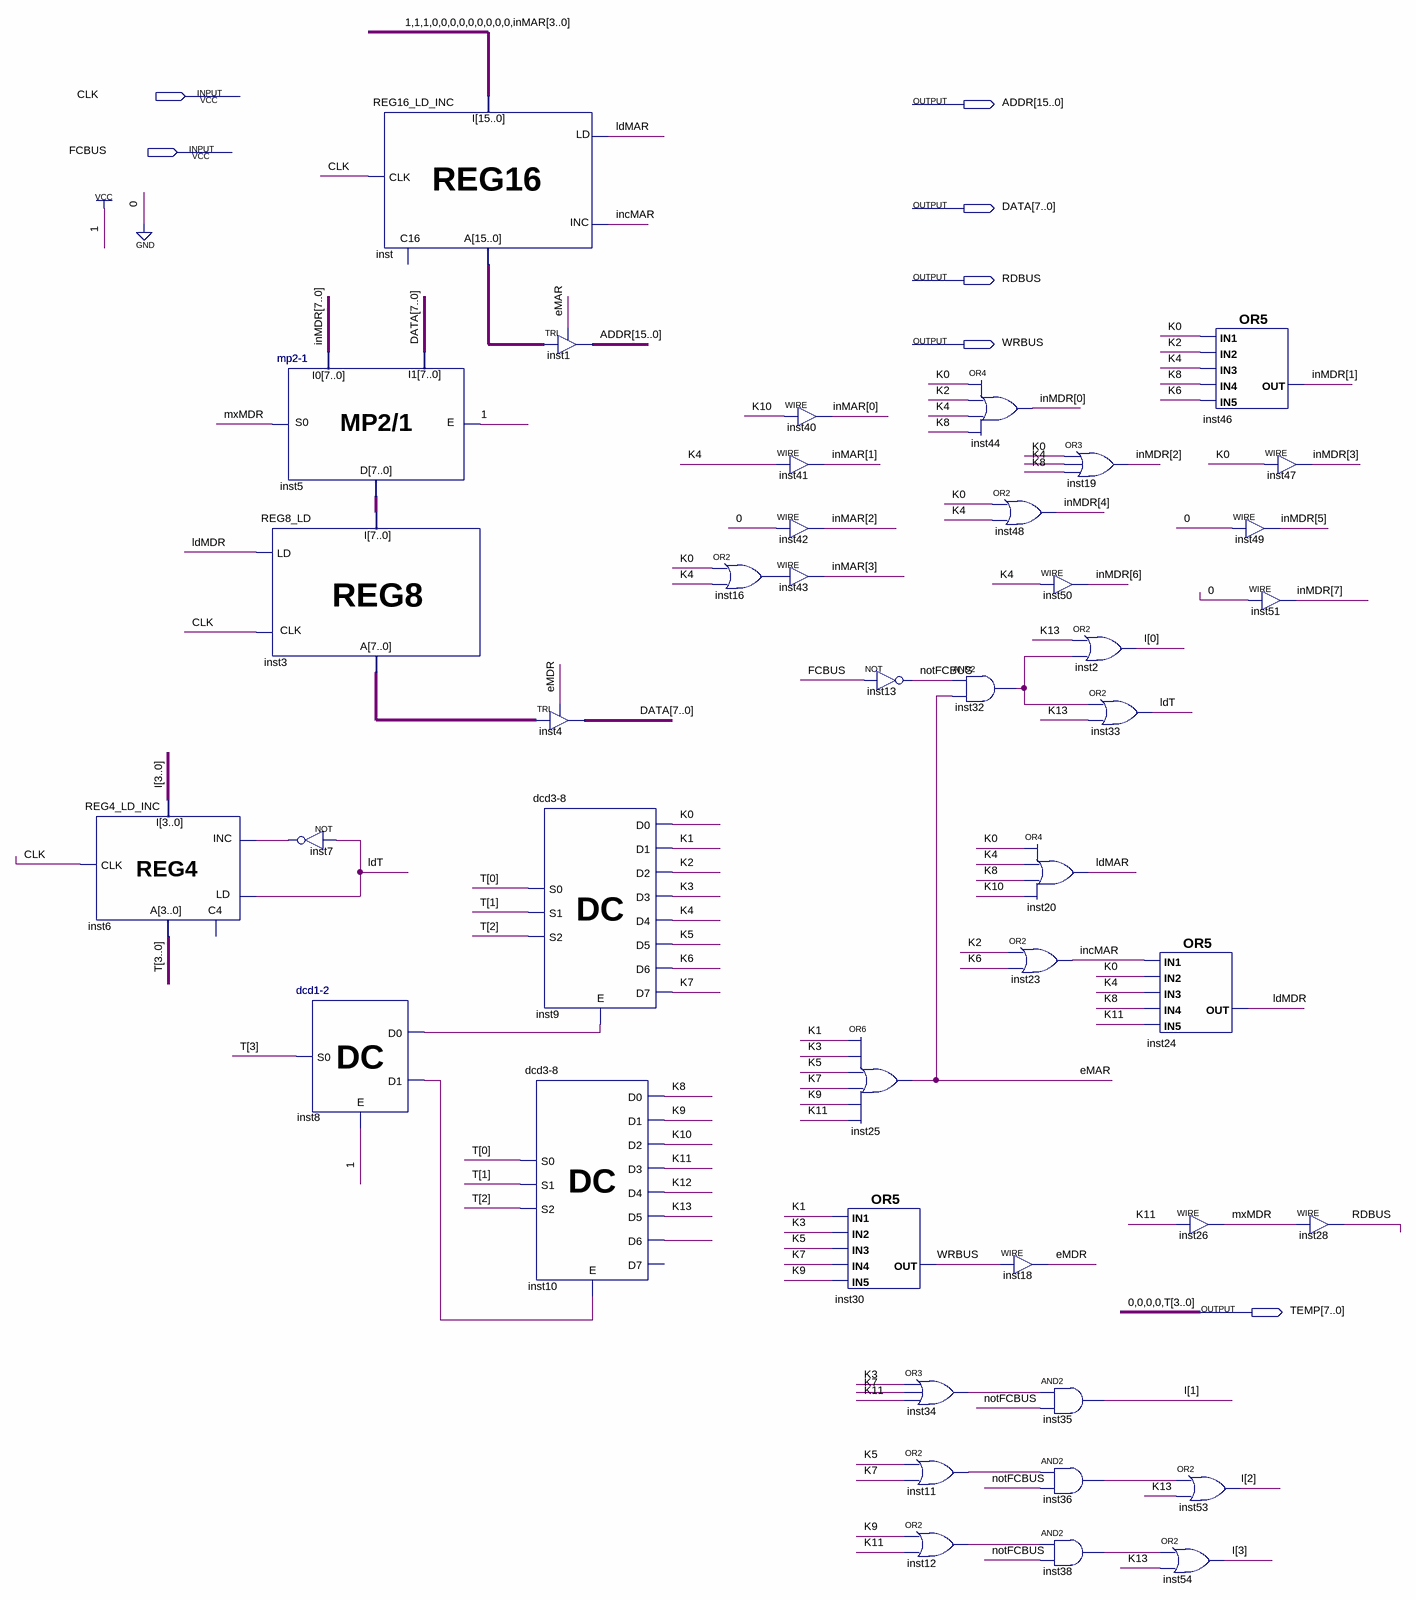
[diagram p0: schematic sheet]
// Quartus schematic testGPU.bdf as structural Verilog: 43 symbols, 7 pins
module testGPU (
  input  CLK,
  input  FCBUS,
  output [15:0] ADDR,
  output [7:0] DATA,
  output RDBUS,
  output WRBUS,
  output [7:0] TEMP
);

  wire eMAR, eMDR, incMAR, inst7_out, inst8_d0, inst8_d1, inst10_d6, inst11_out, inst12_out, inst16_out,
       inst32_out, inst34_out, inst36_out, inst38_out, K0, K1, K2, K3, K4, K5, K6, K7, K8, K9, K10, K11, K12,
       K13, ldMAR, ldMDR, ldT, mxMDR, notFCBUS;
  wire [3:0] I, inMAR;
  wire [7:0] inMDR, inst3_a, inst5_d;
  wire [15:0] inst_a;

  REG4_LD_INC inst6 (.LD(ldT), .INC(inst7_out), .CLK(CLK), .I(I), .A(TEMP[3:0]));  // open: C4
  REG8_LD inst3 (.I(inst5_d), .CLK(CLK), .LD(ldMDR), .A(inst3_a));
  \mp2-1  inst5 (.E(1'b1), .S0(mxMDR), .I0(inMDR), .I1(DATA), .D(inst5_d));
  not inst7 (inst7_out, ldT);
  \dcd1-2  inst8 (.E(1'b1), .S0(TEMP[3]), .D0(inst8_d0), .D1(inst8_d1));
  REG16_LD_INC inst (.I({12'b111000000000, inMAR}), .CLK(CLK), .LD(ldMAR), .INC(incMAR), .A(inst_a));  // open: C16
  \dcd3-8  inst10 (
    .E(inst8_d1), .S0(TEMP[0]), .S1(TEMP[1]), .S2(TEMP[2]), .D0(K8), .D1(K9), .D2(K10), .D3(K11), .D4(K12),
    .D5(K13), .D6(inst10_d6));  // open: D7
  TRI inst1[15:0] (.IN(inst_a), .OE(eMAR), .OUT(ADDR));
  TRI inst4[7:0] (.IN(inst3_a), .OE(eMDR), .OUT(DATA));
  \dcd3-8  inst9 (
    .E(inst8_d0), .S0(TEMP[0]), .S1(TEMP[1]), .S2(TEMP[2]), .D0(K0), .D1(K1), .D2(K2), .D3(K3), .D4(K4),
    .D5(K5), .D6(K6), .D7(K7));
  or inst16 (inst16_out, K0, K4);
  assign inMAR[1] = K4;  // WIRE inst41
  assign inMAR[2] = 1'b0;  // WIRE inst42
  assign inMAR[3] = inst16_out;  // WIRE inst43
  assign inMAR[0] = K10;  // WIRE inst40
  or inst30 (WRBUS, K1, K3, K5, K7, K9);
  not inst13 (notFCBUS, FCBUS);
  or inst25 (eMAR, K1, K3, K5, K7, K9, K11);
  or inst34 (inst34_out, K3, K7, K11);
  or inst11 (inst11_out, K5, K7);
  or inst12 (inst12_out, K9, K11);
  or inst44 (inMDR[0], K0, K2, K4, K8);
  and inst32 (inst32_out, notFCBUS, eMAR);
  or inst48 (inMDR[4], K0, K4);
  or inst20 (ldMAR, K0, K4, K8, K10);
  or inst23 (incMAR, K2, K6);
  assign eMDR = WRBUS;  // WIRE inst18
  or inst19 (inMDR[2], K0, K4, K8);
  assign inMDR[6] = K4;  // WIRE inst50
  or inst2 (I[0], K13, inst32_out);
  or inst33 (ldT, inst32_out, K13);
  and inst35 (I[1], inst34_out, notFCBUS);
  and inst36 (inst36_out, inst11_out, notFCBUS);
  and inst38 (inst38_out, inst12_out, notFCBUS);
  or inst24 (ldMDR, incMAR, K0, K4, K8, K11);
  or inst54 (I[3], inst38_out, K13);
  or inst46 (inMDR[1], K0, K2, K4, K8, K6);
  assign mxMDR = K11;  // WIRE inst26
  or inst53 (I[2], inst36_out, K13);
  assign inMDR[3] = K0;  // WIRE inst47
  assign inMDR[5] = 1'b0;  // WIRE inst49
  assign inMDR[7] = 1'b0;  // WIRE inst51
  assign RDBUS = mxMDR;  // WIRE inst28

  assign TEMP[7:4] = 4'b0000;

  // Other names for the same wires on the sheet: T[3:0] = TEMP[3:0]
endmodule
